# Altium schematic sheet Sheet2.SchDoc
size A
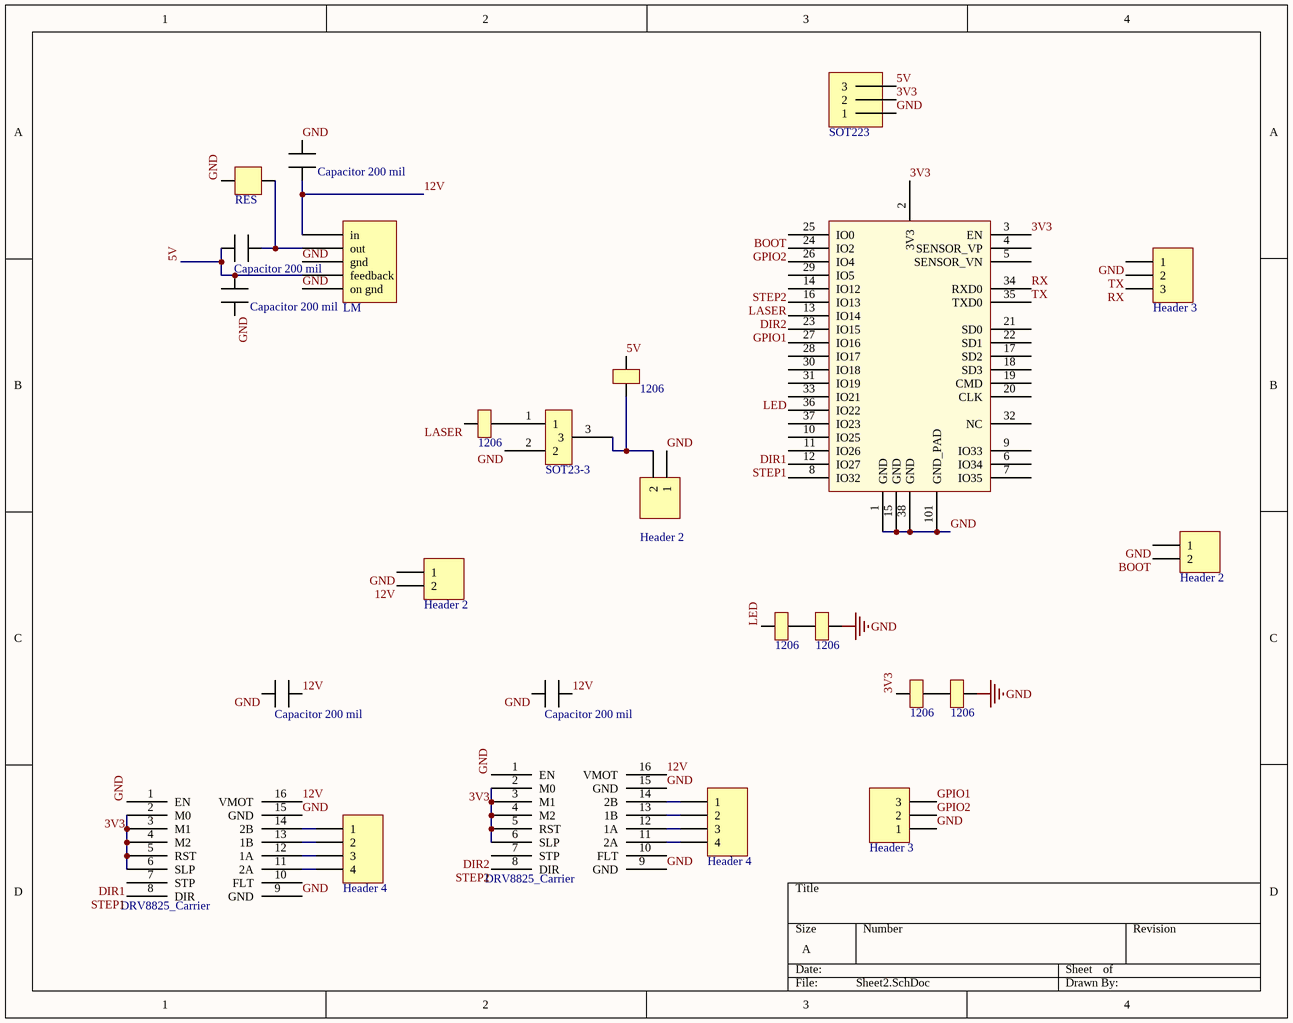
[diagram p0: Sheet2.SchDoc]

## Parts
(Parts that share a designator on the sheet are numbered #1, #2 ... from top to bottom, then left to right.)
?#1  SOT223  [SOT223]
?#2  RES  [LINEAR 100 MIL]
?#3  Capacitor 200 mil  [circular 200 mil]
?#4  LM  [TO 22Ö]
?#5  Capacitor 200 mil  [circular 200 mil]
?#6  Header 3  [HDR1X3]
?#7  Capacitor 200 mil  [circular 200 mil]
?#8  ESP32S_Module  [ESP32S_W]  (value not drawn)
?#9  1206  [1206]
?#10  1206  [1206]
?#11  SOT23-3  [SOT23-3]
?#12  Header 2  [HDR1X2]
?#13  Header 2  [HDR1X2]
?#14  Header 2  [HDR1X2]
?#15  1206  [1206]
?#16  1206  [1206]
?#17  Capacitor 200 mil  [circular 200 mil]
?#18  Capacitor 200 mil  [circular 200 mil]
?#19  1206  [1206]
?#20  1206  [1206]
?#21  DRV8825_Carrier  [DRV8825 Carrier]
?#22  Header 4  [HDR1X4]
?#23  DRV8825_Carrier  [DRV8825 Carrier]
?#24  Header 4  [HDR1X4]
?#25  Header 3  [HDR1X3]

## Nets
GND: ?#1.1 ?#2.1 ?#3.1 ?#4.3(gnd) ?#4.5(on_gnd) ?#6.1 ?#7.1 ?#8.1(GND) ?#8.15(GND) ?#8.38(GND) ?#8.101(GND_PAD) ?#11.2 ?#12.1 ?#13.1 ?#14.1 ?#16.2 ?#17.1 ?#18.1 ?#20.2 ?#21.1(EN) ?#21.9(GND) ?#21.15(GND) ?#23.1(EN) ?#23.9(GND) ?#23.15(GND) ?#25.1
3V3: ?#1.2 ?#8.2(3V3) ?#8.3(EN) ?#19.1 ?#21.2(M0) ?#21.3(M1) ?#21.4(M2) ?#21.5(RST) ?#21.6(SLP) ?#23.2(M0) ?#23.3(M1) ?#23.4(M2) ?#23.5(RST) ?#23.6(SLP)
5V: ?#1.3 ?#4.4(feedback) ?#5.1 ?#7.2 ?#9.2
12V: ?#3.2 ?#4.1(in) ?#14.2 ?#17.2 ?#18.2 ?#21.16(VMOT) ?#23.16(VMOT)
BOOT: ?#8.25(IO0) ?#13.2
DIR1: ?#8.11(IO26) ?#23.7(STP)
DIR2: ?#8.13(IO14) ?#21.7(STP)
GPIO1: ?#8.23(IO15) ?#25.3
GPIO2: ?#8.24(IO2) ?#25.2
LASER: ?#8.16(IO13) ?#10.1
LED: ?#8.33(IO21) ?#15.1
RX: ?#6.3 ?#8.34(RXD0)
STEP1: ?#8.12(IO27) ?#23.8(DIR)
STEP2: ?#8.14(IO12) ?#21.8(DIR)
TX: ?#6.2 ?#8.35(TXD0)
Net?#2_2: ?#2.2 ?#4.2(out) ?#5.2
Net?#9_1: ?#9.1 ?#11.3 ?#12.2
Net?#10_2: ?#10.2 ?#11.1
Net?#15_2: ?#15.2 ?#16.1
Net?#19_2: ?#19.2 ?#20.1
Net?#21_11: ?#21.11(2A) ?#22.4
Net?#21_12: ?#21.12(1A) ?#22.3
Net?#21_13: ?#21.13(1B) ?#22.2
Net?#21_14: ?#21.14(2B) ?#22.1
Net?#23_11: ?#23.11(2A) ?#24.4
Net?#23_12: ?#23.12(1A) ?#24.3
Net?#23_13: ?#23.13(1B) ?#24.2
Net?#23_14: ?#23.14(2B) ?#24.1

Not connected (* = marked no-connect by the designer): ?#8 4(SENSOR_VP) 5(SENSOR_VN) 6(IO34) 7(IO35) 8(IO32) 9(IO33) 10(IO25) 17(SD2) 18(SD3) 19(CMD) 20(CLK) 21(SD0) 22(SD1) 26(IO4) 27(IO16) 28(IO17) 29(IO5) 30(IO18) 31(IO19) 32(NC) 36(IO22) 37(IO23); ?#21 10(FLT); ?#23 10(FLT)

## Library data of the parts
?#1 = SOT223: 3v3 regulator
?#3 ?#5 ?#7 ?#17 ?#18 = CAP: Capacitor 200 mil pin distance
?#6 ?#25 = Header 3: Header, 3-Pin; LatestRevisionDate: 17-Jul-2002; LatestRevisionNote: Re-released for DXP Platform.; Publisher: Altium Limited
?#8 = ESP32S_Module: Esp-32S; Datasheet: https://espressif.com/sites/default/files/documentation/esp_wroom_32_datasheet_en.pdf
?#12-?#14 = Header 2: Header, 2-Pin; LatestRevisionDate: 17-Jul-2002; LatestRevisionNote: Re-released for DXP Platform.; Publisher: Altium Limited
?#21 ?#23 = DRV8825_Carrier: Carrier PCB for DRV8825
?#22 ?#24 = Header 4: Header, 4-Pin; LatestRevisionDate: 17-Jul-2002; LatestRevisionNote: Re-released for DXP Platform.; Publisher: Altium Limited